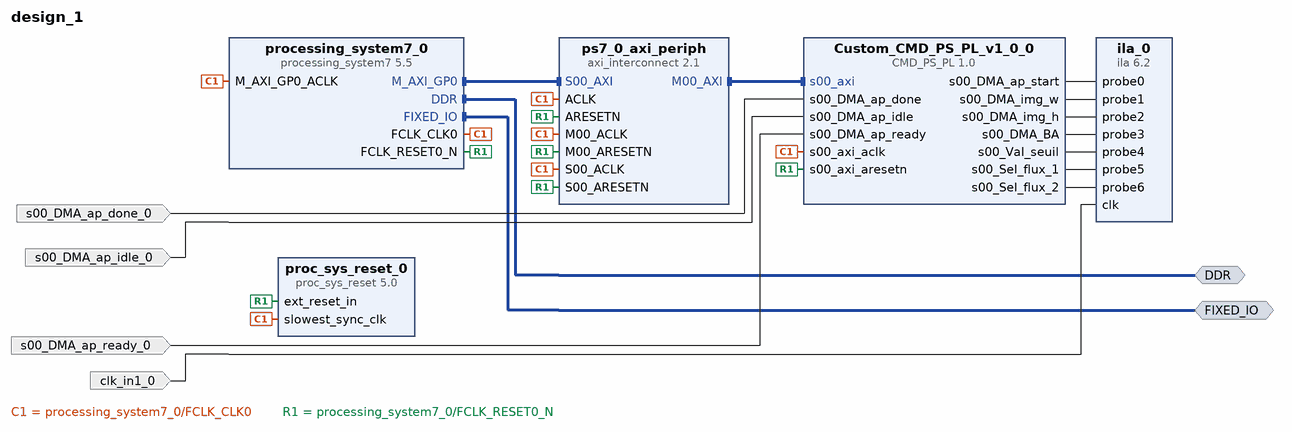
[diagram p0: block diagram of the top level]
# Vivado block design design_1, xc7z010clg400-1, Vivado 2020.2
create_bd_design design_1

create_bd_intf_port -mode Master -vlnv xilinx.com:interface:ddrx_rtl:1.0 DDR
create_bd_intf_port -mode Master -vlnv xilinx.com:display_processing_system7:fixedio_rtl:1.0 FIXED_IO
create_bd_port -dir I s00_DMA_ap_done_0
create_bd_port -dir I s00_DMA_ap_idle_0
create_bd_port -dir I s00_DMA_ap_ready_0
create_bd_port -dir I -type clk clk_in1_0
set_property -dict {CONFIG.FREQ_HZ 125000000} [get_bd_ports clk_in1_0]

create_bd_cell -type ip -vlnv xilinx.com:ip:processing_system7:5.5 processing_system7_0
set_property -dict [list \
  CONFIG.PCW_APU_PERIPHERAL_FREQMHZ 650 \
  CONFIG.PCW_CRYSTAL_PERIPHERAL_FREQMHZ 50 \
  CONFIG.PCW_ENET0_PERIPHERAL_ENABLE 0 \
  CONFIG.PCW_ENET0_RESET_ENABLE 1 \
  CONFIG.PCW_ENET0_RESET_IO {MIO 9} \
  CONFIG.PCW_ENET_RESET_ENABLE 1 \
  CONFIG.PCW_FTM_CTI_IN0 DISABLED \
  CONFIG.PCW_FTM_CTI_IN1 DISABLED \
  CONFIG.PCW_FTM_CTI_IN2 DISABLED \
  CONFIG.PCW_FTM_CTI_IN3 DISABLED \
  CONFIG.PCW_FTM_CTI_OUT0 DISABLED \
  CONFIG.PCW_FTM_CTI_OUT1 DISABLED \
  CONFIG.PCW_FTM_CTI_OUT2 DISABLED \
  CONFIG.PCW_FTM_CTI_OUT3 DISABLED \
  CONFIG.PCW_GPIO_MIO_GPIO_ENABLE 1 \
  CONFIG.PCW_GPIO_MIO_GPIO_IO MIO \
  CONFIG.PCW_I2C_RESET_ENABLE 1 \
  CONFIG.PCW_PRESET_BANK1_VOLTAGE {LVCMOS 1.8V} \
  CONFIG.PCW_QSPI_PERIPHERAL_ENABLE 0 \
  CONFIG.PCW_SD0_GRP_CD_ENABLE 1 \
  CONFIG.PCW_SD0_GRP_CD_IO {MIO 47} \
  CONFIG.PCW_SD0_GRP_WP_ENABLE 0 \
  CONFIG.PCW_SD0_PERIPHERAL_ENABLE 1 \
  CONFIG.PCW_SD0_SD0_IO {MIO 40 .. 45} \
  CONFIG.PCW_SDIO_PERIPHERAL_FREQMHZ 100 \
  CONFIG.PCW_UART0_PERIPHERAL_ENABLE 1 \
  CONFIG.PCW_UART0_UART0_IO {MIO 14 .. 15} \
  CONFIG.PCW_UART_PERIPHERAL_FREQMHZ 100 \
  CONFIG.PCW_UIPARAM_DDR_BUS_WIDTH {16 Bit} \
  CONFIG.PCW_UIPARAM_DDR_FREQ_MHZ 525 \
  CONFIG.PCW_UIPARAM_DDR_PARTNO {MT41K256M16 RE-125} \
  CONFIG.PCW_USB0_PERIPHERAL_ENABLE 0 \
  CONFIG.PCW_USB0_RESET_ENABLE 1 \
  CONFIG.PCW_USB0_RESET_IO {MIO 46} \
  CONFIG.PCW_USB_RESET_ENABLE 1 \
  CONFIG.PCW_USE_CROSS_TRIGGER 1 \
] [get_bd_cells processing_system7_0]
# 291 more settings of processing_system7_0 are not shown: defaults, MIO pin electricals, DDR timing, and values the tool derives
create_bd_cell -type ip -vlnv xilinx.com:ip:axi_interconnect:2.1 ps7_0_axi_periph
set_property -dict {CONFIG.NUM_MI 1} [get_bd_cells ps7_0_axi_periph]
create_bd_cell -type ip -vlnv xilinx.com:ip:ila:6.2 ila_0
set_property -dict [list \
  CONFIG.C_DATA_DEPTH 8192 \
  CONFIG.C_ENABLE_ILA_AXI_MON false \
  CONFIG.C_MONITOR_TYPE Native \
  CONFIG.C_NUM_OF_PROBES 7 \
  CONFIG.C_TRIGIN_EN false \
] [get_bd_cells ila_0]
create_bd_cell -type ip -vlnv xilinx.com:ip:proc_sys_reset:5.0 proc_sys_reset_0
create_bd_cell -type ip -vlnv xilinx.com:user:CMD_PS_PL:1.0 Custom_CMD_PS_PL_v1_0_0

# ---- connections ----

connect_bd_intf_net [get_bd_intf_ports DDR] [get_bd_intf_pins processing_system7_0/DDR]
connect_bd_intf_net [get_bd_intf_pins ps7_0_axi_periph/M00_AXI] [get_bd_intf_pins Custom_CMD_PS_PL_v1_0_0/s00_axi]
connect_bd_intf_net [get_bd_intf_ports FIXED_IO] [get_bd_intf_pins processing_system7_0/FIXED_IO]
connect_bd_intf_net [get_bd_intf_pins processing_system7_0/M_AXI_GP0] [get_bd_intf_pins ps7_0_axi_periph/S00_AXI]
connect_bd_net [get_bd_pins Custom_CMD_PS_PL_v1_0_0/s00_DMA_ap_start] [get_bd_pins ila_0/probe0]
connect_bd_net [get_bd_pins Custom_CMD_PS_PL_v1_0_0/s00_DMA_img_w] [get_bd_pins ila_0/probe1]
connect_bd_net [get_bd_pins Custom_CMD_PS_PL_v1_0_0/s00_DMA_img_h] [get_bd_pins ila_0/probe2]
connect_bd_net [get_bd_pins Custom_CMD_PS_PL_v1_0_0/s00_DMA_BA] [get_bd_pins ila_0/probe3]
connect_bd_net [get_bd_pins Custom_CMD_PS_PL_v1_0_0/s00_Val_seuil] [get_bd_pins ila_0/probe4]
connect_bd_net [get_bd_pins Custom_CMD_PS_PL_v1_0_0/s00_Sel_flux_1] [get_bd_pins ila_0/probe5]
connect_bd_net [get_bd_pins Custom_CMD_PS_PL_v1_0_0/s00_Sel_flux_2] [get_bd_pins ila_0/probe6]
connect_bd_net [get_bd_pins processing_system7_0/FCLK_CLK0] \
  [get_bd_pins processing_system7_0/M_AXI_GP0_ACLK] [get_bd_pins ps7_0_axi_periph/M00_ACLK] \
  [get_bd_pins ps7_0_axi_periph/S00_ACLK] [get_bd_pins ps7_0_axi_periph/ACLK] [get_bd_pins proc_sys_reset_0/slowest_sync_clk] \
  [get_bd_pins Custom_CMD_PS_PL_v1_0_0/s00_axi_aclk]
connect_bd_net -net s00_DMA_ap_done_0_1 [get_bd_ports s00_DMA_ap_done_0] [get_bd_pins Custom_CMD_PS_PL_v1_0_0/s00_DMA_ap_done]
connect_bd_net -net s00_DMA_ap_idle_0_1 [get_bd_ports s00_DMA_ap_idle_0] [get_bd_pins Custom_CMD_PS_PL_v1_0_0/s00_DMA_ap_idle]
connect_bd_net -net s00_DMA_ap_ready_0_1 [get_bd_ports s00_DMA_ap_ready_0] [get_bd_pins Custom_CMD_PS_PL_v1_0_0/s00_DMA_ap_ready]
connect_bd_net -net clk_125Mhz_1 [get_bd_ports clk_in1_0] [get_bd_pins ila_0/clk]
connect_bd_net [get_bd_pins processing_system7_0/FCLK_RESET0_N] \
  [get_bd_pins proc_sys_reset_0/ext_reset_in] [get_bd_pins ps7_0_axi_periph/S00_ARESETN] \
  [get_bd_pins ps7_0_axi_periph/M00_ARESETN] [get_bd_pins ps7_0_axi_periph/ARESETN] \
  [get_bd_pins Custom_CMD_PS_PL_v1_0_0/s00_axi_aresetn]

# ---- address map ----
assign_bd_address -offset 0x43C00000 -range 64K -target_address_space [get_bd_addr_spaces processing_system7_0/Data] [get_bd_addr_segs Custom_CMD_PS_PL_v1_0_0/s00_axi/reg0]

validate_bd_design
save_bd_design
